# EAGLE design V4-AddOnZigbee-SMD-V002 (EAGLE 9.3.0)
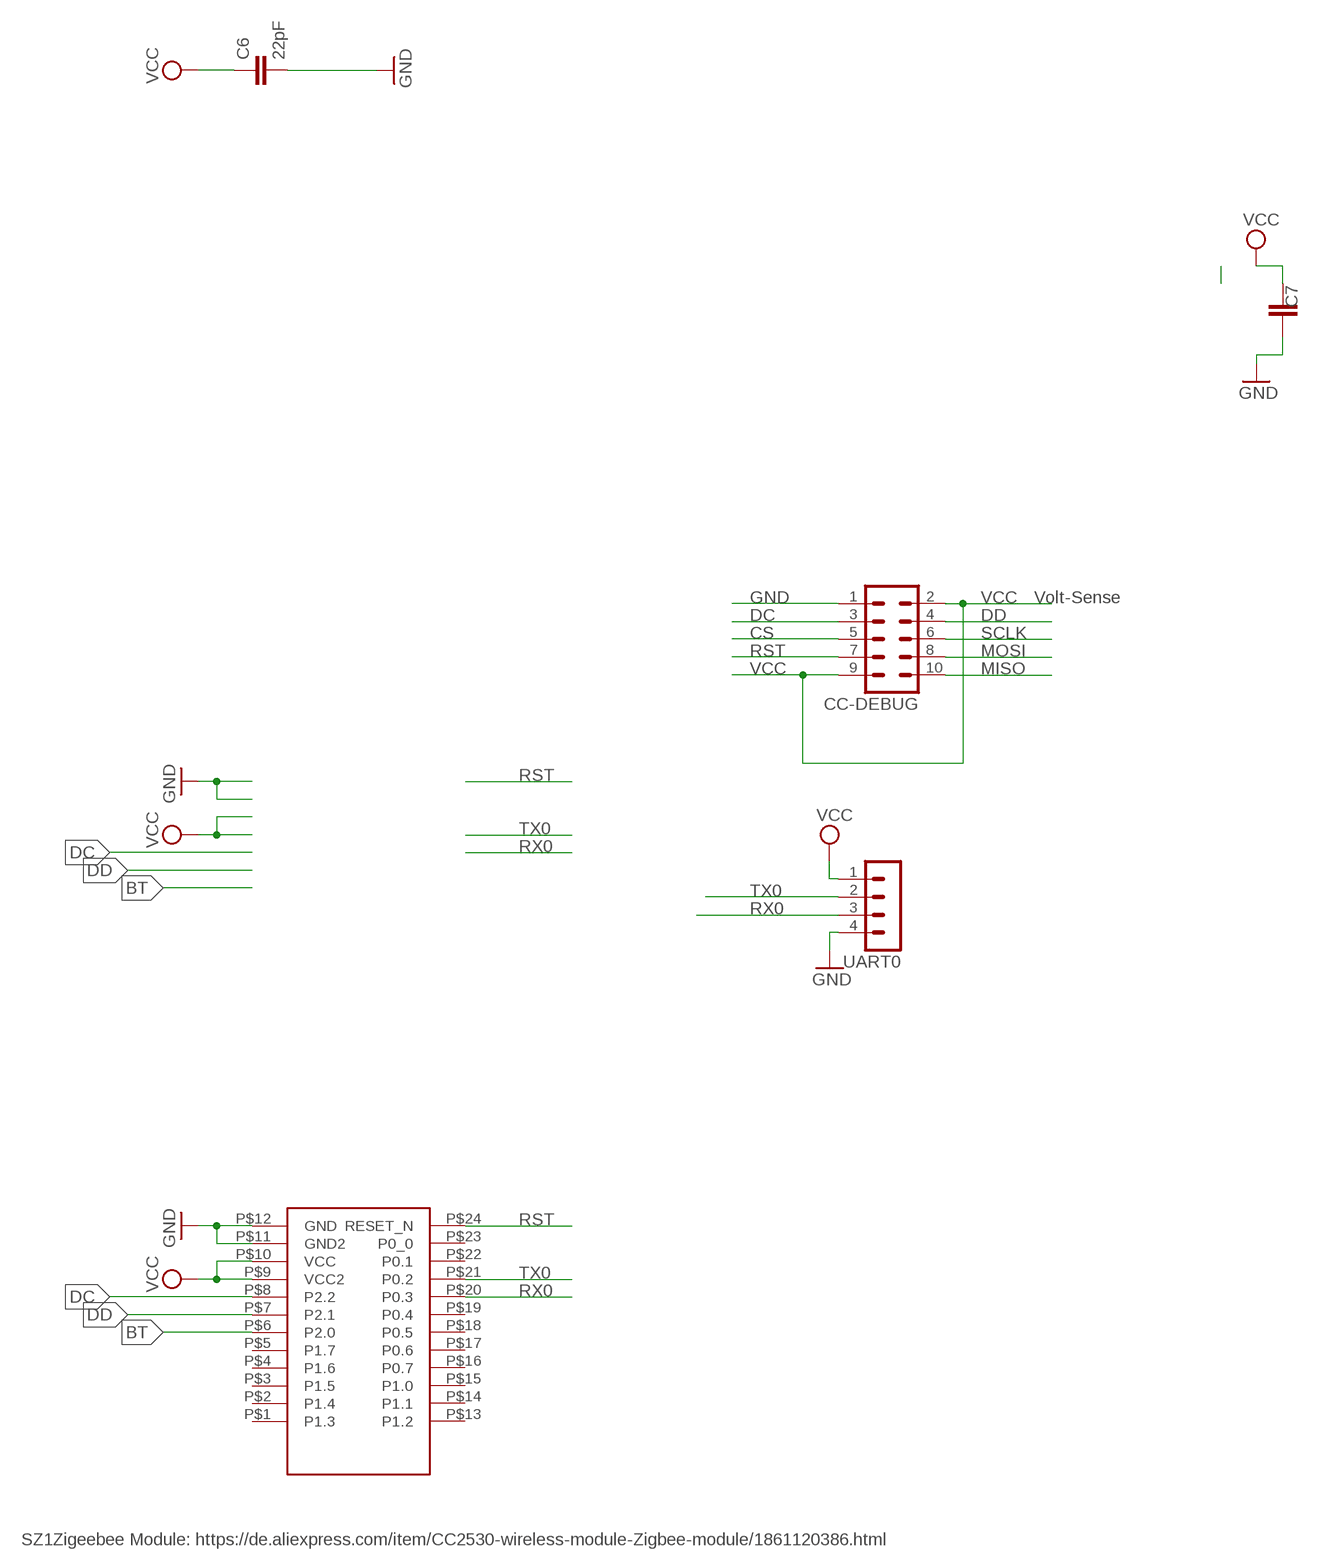
[diagram p0: schematic, sheet 1]

## Parts
C6  22pF  C-EUC0805  [C0805]
C7  C-EUC1812  [C1812]
CC-DEBUG  MA05-2  [MA05-2]
U$1  CC2530  [SZ1ZIGBEE-SMD]
UART0  MA04-1  [MA04-1]

## Nets
BT: U$1.P$6(P2.0)
CS: CC-DEBUG.5
DC: CC-DEBUG.3 U$1.P$8(P2.2)
DD: CC-DEBUG.4 U$1.P$7(P2.1)
GND [PWR]: C6.2 C7.1 CC-DEBUG.1 U$1.P$11(GND2) U$1.P$12(GND) UART0.4
MISO: CC-DEBUG.10
MOSI: CC-DEBUG.8
RST: CC-DEBUG.7 U$1.P$24(RESET_N)
RX0: U$1.P$20(P0.3) UART0.3
SCLK: CC-DEBUG.6
TX0: U$1.P$21(P0.2) UART0.2
VCC [PWR]: C6.1 C7.2 CC-DEBUG.2 CC-DEBUG.9 U$1.P$9(VCC2) U$1.P$10(VCC) UART0.1
Unconnected: U$1.P$1(P1.3) U$1.P$2(P1.4) U$1.P$3(P1.5) U$1.P$4(P1.6) U$1.P$5(P1.7) U$1.P$13(P1.2) U$1.P$14(P1.1) U$1.P$15(P1.0) U$1.P$16(P0.7) U$1.P$17(P0.6) U$1.P$18(P0.5) U$1.P$19(P0.4) U$1.P$22(P0.1) U$1.P$23(P0_0)

## Notes on the sheet
- Volt-Sense
- SZ1Zigeebee Module: https://de.aliexpress.com/item/CC2530-wireless-module-Zigbee-module/1861120386.html

## Library data of the parts
C6 C7 = rcl:C-EU: CAPACITOR, European symbol; SPICEPREFIX: C
CC-DEBUG = con-lstb:MA05-2: PIN HEADER; OC_FARNELL: unknown; OC_NEWARK: unknown
U$1 = zigbee:CC2530: CC2530 Wireless Zigbee Module 3.0-3.6V 2.405-2.485GHz SMD Pads !
UART0 = con-lstb:MA04-1: PIN HEADER; OC_FARNELL: unknown; OC_NEWARK: unknown

## Net classes
0 default: width 0.305 mm
1 PWR: width 0.61 mm

## Board
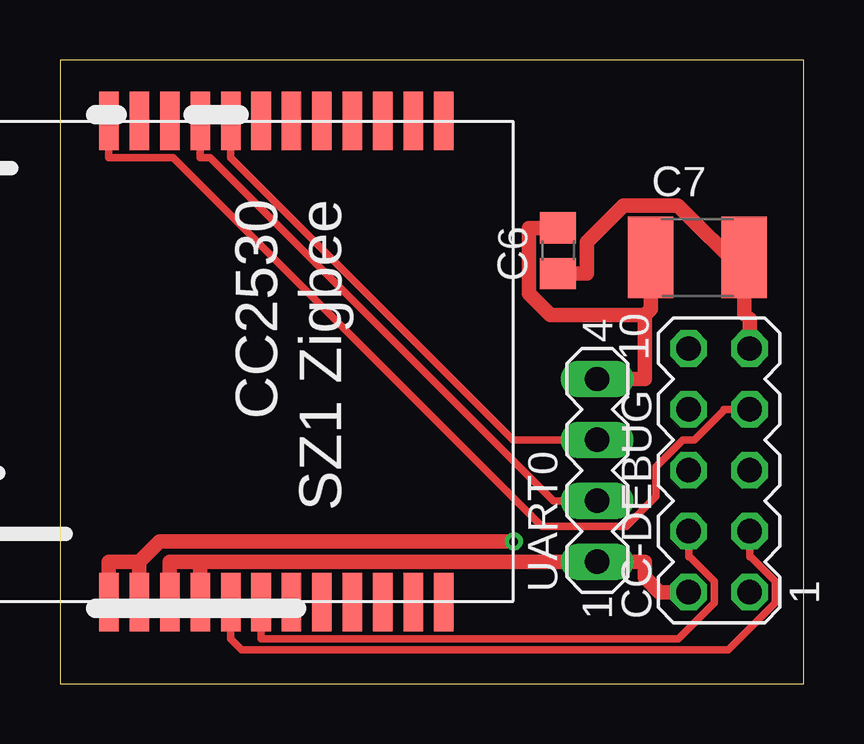
[diagram p1: board, top side]
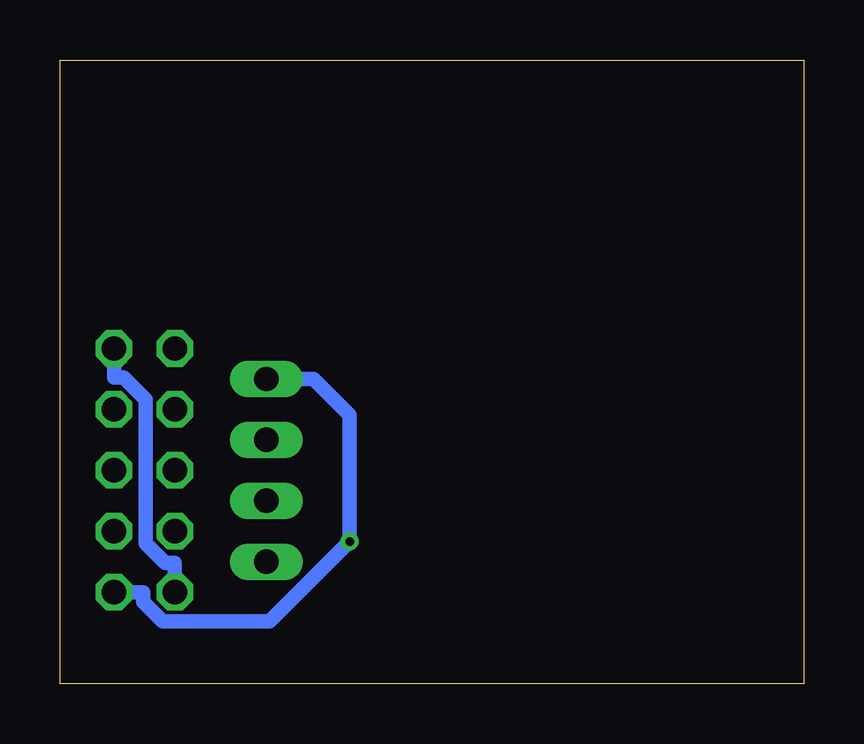
[diagram p2: board, bottom side, seen from below]

Size 31 x 26 mm. Coordinates in mm from the lower left corner, seen from the top.
Outline: 0,0 31,0 31,26 0,26 0,0
Copper layers (1*16): Top 0.035mm / dielectric 1.5mm / Bottom 0.035mm
Design rules "default": minimum track width 6mil, minimum drill 0.35mm, track to track 6mil, track to pad 6mil, pad to pad 6mil, via to via 6mil, smd to smd 6mil, copper to edge 40mil, drill to drill 6mil, minimum pad ring 10mil, minimum via ring 8mil, stop-mask expansion 4mil, vias tented up to drill 0mil, thermal gap 10mil

### Footprints (pad centres in the part's own frame; a part is rotated, then mirrored left to right if it is on the bottom)
C0805 = smd 1.3 x 1.5: 1 -0.95,0; 2 0.95,0
C1812 = smd 1.9 x 3.4: 1 -1.95,0; 2 1.95,0
MA05-2 = drill 1.016 octagon: 1 -5.08,-1.27; 2 -5.08,1.27; 3 -2.54,-1.27; 4 -2.54,1.27; 5 0,-1.27; 6 0,1.27; 7 2.54,-1.27; 8 2.54,1.27; 9 5.08,-1.27; 10 5.08,1.27
SZ1ZIGBEE-SMD = smd 2.438 x 0.813: P$1 -10.036,-12.101; P$2 -10.036,-10.831; P$3 -10.036,-9.561; P$4 -10.036,-8.291; P$5 -10.036,-7.021; P$6 -10.036,-5.751; P$7 -10.036,-4.481; P$8 -10.036,-3.211; P$9 -10.036,-1.941; P$10 -10.036,-0.671; P$11 -10.036,0.599; P$12 -10.036,1.869; P$13 10.03,-12.101; P$14 10.03,-10.831; P$15 10.03,-9.561; P$16 10.03,-8.291; P$17 10.03,-7.021; P$18 10.03,-5.751; P$19 10.03,-4.481; P$20 10.03,-3.211; P$21 10.03,-1.941; P$22 10.03,-0.671; P$23 10.03,0.599; P$24 10.03,1.869
MA04-1 = drill 1.016 long: 1 -3.81,0; 2 -1.27,0; 3 1.27,0; 4 3.81,0

### Placement (x,y rotation side)
C6  20.77,18.05 90 top
C7  26.57,17.77 0 top
CC-DEBUG  27.48,8.89 90 top
U$1  3.91,13.43 90 top
UART0  22.4,8.89 90 top

### Tracks (layer width: path | path; a pad name or v marks a point on that pad's centre or on a via)
DC
  Top 0.305: U$1.P$8 7.12,1.87 7.58,1.41 27.86,1.41 29.82,3.37 29.82,4.25 28.79,5.28 28.75,5.28 CC-DEBUG.3
DD
  Top 0.305: CC-DEBUG.4 26.21,5.28 26.25,5.28 27.28,4.26 27.28,3.36 25.79,1.87 8.39,1.87 U$1.P$7
GND  (via drill 0.35 pad 0.76)
  Top 0.61: 3.31,5.07 4.16,5.92 v18.92,5.92 | 3.31,5.07 2.04,5.07 U$1.P$12 | U$1.P$11 3.31,5.07 | 24.38,15.36 24.62,15.61 C7.1 | 24.38,15.36 24.38,12.7 UART0.4 | 24.38,15.36 20.45,15.36 19.56,16.25 19.56,19 C6.2
  Bottom 0.61: CC-DEBUG.1 27.53,3.81 27.53,3.4 26.72,2.59 22.25,2.59 v18.92,5.92 18.92,11.2 20.42,12.7 UART0.4
RST
  Top 0.305: CC-DEBUG.7 27.68,11.43 27.68,11.39 26.45,10.16 25.97,10.16 24.85,9.04 24.85,7.79 23.6,6.55 20.1,6.55 4.71,21.94 2.04,21.94 U$1.P$24
RX0
  Top 0.305: U$1.P$20 7.12,21.94 18.89,10.16 UART0.3
TX0
  Top 0.305: U$1.P$21 5.85,21.94 6.26,21.94 20.57,7.62 UART0.2
VCC
  Top 0.61: CC-DEBUG.9 28.75,15.19 28.52,15.41 28.52,16.69 | 5.85,5.07 20.41,5.07 20.42,5.08 UART0.1 24.38,5.08 24.38,4.42 24.99,3.81 CC-DEBUG.2 | C6.1 21.97,17.1 21.97,18.41 23.48,19.92 25.77,19.92 28.52,17.17 28.52,16.69 | C7.2 28.52,16.69 | U$1.P$9 5.85,5.07 | U$1.P$10 4.58,5.07 5.85,5.07
  Bottom 0.61: CC-DEBUG.9 28.75,12.75 28.34,12.75 27.43,11.84 27.43,5.84 26.62,5.03 26.21,5.03 CC-DEBUG.2